# Altium schematic sheet 5VProtect.SchDoc
size B; SheetNumber: 11; SheetTotal: 15
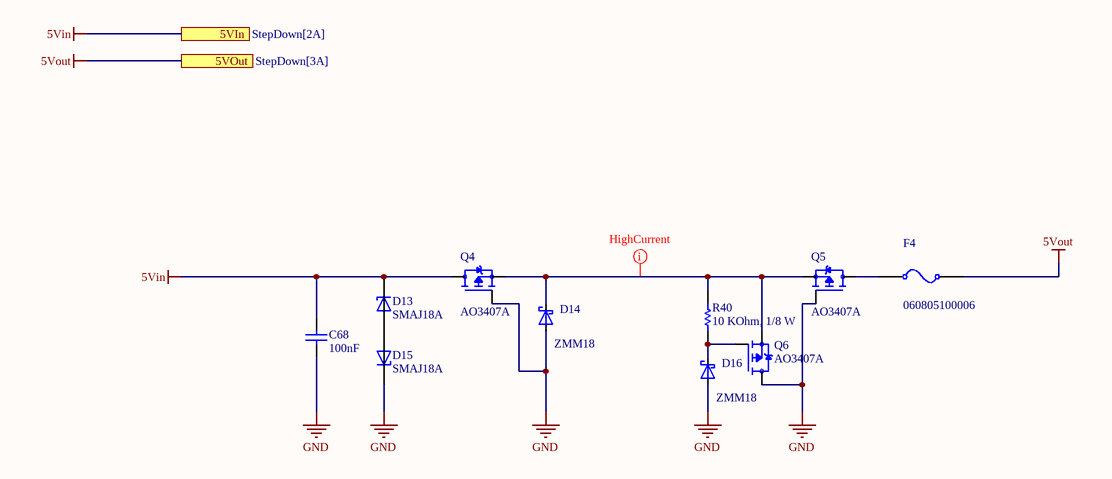
[diagram p0: 5VProtect.SchDoc]

## Parts
C68  value 100nF  [CAP_0805]  (hidden comment: 0108051041050)
D13  SMAJ18A  [DIOM4325X250N]
D14  ZMM18  [SOD-80_MiniMELF_Glass]
D15  SMAJ18A  [DIOM4325X250N]
D16  ZMM18  [SOD-80_MiniMELF_Glass]
F4  060805100006  [Fuse_SMD_0805]
Q4  AO3407A  [SOT95P280X125-3N]
Q5  AO3407A  [SOT95P280X125-3N]
Q6  AO3407A  [SOT95P280X125-3N]
R40  value 10 KOhm, 1/8 W  [RESISTOR_0805]  (hidden comment: 0008051031)

## Ports
5VIn (see StepDown[2A]), 5VOut (see StepDown[3A])

## Nets
5Vin: C68.2 D13.C Q4.3(D) ; port 5VIn
5Vout: F4.1 ; port 5VOut
GND: C68.1 D14.A D15.C D16.A Q4.1(G) Q5.1(G) Q6.3(D)
NetD13_A: D13.A D15.A
NetD14_K: D14.K Q4.2(S) Q5.2(S) Q6.2(S) R40.2
NetD16_K: D16.K Q6.1(G) R40.1
NetF4_0: F4.0 Q5.3(D)

## Layout directives
rule Width Constraint [Pref Width = 0.508mm    Min Width = 0.127mm    Max Width = 25.4mm]: NetD14_K

## Library data of the parts
C68 = CMP-001-00259-1: CAP, size 0805, 0.1 nF, 50 VDC; Manufacture Name: TDK; Manufacture SN: CGA4J2X8R1H104K125AD; Voltage Rating DC: 50 VDC; Tolerance: 10%; Pins: 2; Supplier 2 URL: https://www.digikey.com/en/products/detail/tdk-corporation/cga4j2x8r1h104k125ad/3248169; Supplier 1 SN: 810-C2012X8R1H104KEP; Supplier 1 Name: Mouser; Supplier 3 Name: thegioiic; Mounting Technology: SMT; Source: Capacitor_0805_10_percent.SchLib; Supplier 2 SN: 445-8810-2-ND; Supplier 3 SN: OEM; Operating Temperature: -55 to +125degC; Supplier 2 Name: Digi-Key; Component Type: Standard; Design Item ID: 0108051041050; Supplier 1 URL: https://www.mouser.vn/ProductDetail/TDK/CGA4J2X8R1H104K125AD?qs=LcTL%2F5vFEzExqZqv3rh1qQ%3D%3D&utm_source=mouser-refine-download&utm_medium=file&utm_campaign=CGA4J2X8R1H104K125AD&utm_content=TDK; Supplier 3 URL: N/A; Packaging: Tape and Reel; Size: 0805
D13 D15 = CMP-004-00085-1: 400W, 21.1V, 5%, Unidirectional, TVS; MF: Taiwan Semiconductor; SnapEDA_Link: https://www.snapeda.com/parts/SMAJ18A/taiwan/view-part/?ref=snap; Value: *; Component Type: Standard; Case/Package: SMA-2 Taiwan Semiconductor; Check_prices: https://www.snapeda.com/parts/SMAJ18A/taiwan/view-part/?ref=eda; Source: SMAJ18A.SchLib; Design Item ID: SMAJ18A; Pins: 2; MP: SMAJ18A
D14 D16 = CMP-004-00086-2: Value: Shottky-Diode; Reference: D; ki_keywords: Schottky; ki_description: Schottky Diode; Component Type: Standard; Pins: 2; Source: schottky-diode.SchLib; Design Item ID: Schottky-Diode; Datasheet: https://diotec.com/de/produktliste/SBD.html
F4 = CMP-005-00047-1: Resettable Fuse, Size 0805, 6V, 1A; Manufacturer: Littelfuse; Value: 6V,  1A; Threshold Current: 40A; Trip Current: 1.95A; Mounting Technology: SMT/SMD; Supplier 1 URL: https://www.mouser.vn/ProductDetail/Littelfuse/0805L100WR?qs=SJZ%252BTX%252BI2BTMlREVsW49pQ%3D%3D; Supplier 3 Name: thegioiic; Supplier 3 URL: https://www.thegioiic.com/0805l100wr-cau-chi-tu-phuc-hoi-0805-6v-1a; Supplier 3 SN: 0805L100WR; ComponentLink1URL: https://www.littelfuse.com/~/media/electronics/datasheets/resettable_ptcs/littelfuse_ptc_0805l_datasheet.pdf.pdf; Pins: 2; Supplier 1 SN: 576-0805L100; Component Type: Standard; Design Item ID: 060805100006; Threshold Voltage: 6V; ComponentLink1Description: Datasheet link; ComponentLink4Description: Supplier 3 URL; Supplier 1 Name: Mouser; Supplier 2 URL: https://www.mouser.vn/ProductDetail/Littelfuse/0805L100WR?qs=SJZ%252BTX%252BI2BTMlREVsW49pQ%3D%3D; Supplier 2 Name: Digi-Key; ComponentLink2URL: https://www.mouser.vn/ProductDetail/Littelfuse/0805L100WR?qs=SJZ%252BTX%252BI2BTMlREVsW49pQ%3D%3D; Hold Current: 1A; Source: Fuse_SMD.SchLib; ComponentLink3Description: Supplier 2 URL; Size: 0805; ComponentLink2Description: Supplier 1 URL; Supplier 2 SN: F2774TR-ND; ComponentLink3URL: https://www.digikey.com/en/products/detail/littelfuse-inc/0805L100WR/1212824; ComponentLink4URL: https://www.thegioiic.com/0805l100wr-cau-chi-tu-phuc-hoi-0805-6v-1a
Q4-Q6 = CMP-123-000000-1: P-Channel 30 V 4.3A (Ta) 1.4W (Ta) Surface Mount SOT-23-3; MF: Alpha &; Design Item ID: AO3407A; Check_prices: https://www.snapeda.com/parts/AO3407A/Alpha/view-part/?ref=eda; SnapEDA_Link: https://www.snapeda.com/parts/AO3407A/Alpha/view-part/?ref=snap; Source: AO3407A.SchLib; Pin Count: 3; Package: SOT-23 Alpha &amp; Omega Semiconductor; Value: *; Component Type: Standard; MP: AO3407A
R40 = CMP-009-00482-1: RES, size 0805, 10 KOhm, 1/8 W; Manufacture  Name: Vishay Dale; Manufacture  SN: CRCW080515K0FKEAC; Rated Power: 1/8 W; Resistance Tolerance: +/-1%; ComponentLink3URL: https://www.digikey.com/en/products/detail/vishay-dale/CRCW080515K0FKEAC/7928558; Supplier 3 SN: N/A; ComponentLink1URL: https://www.vishay.com/docs/28773/crcwce3.pdf; ComponentLink2Description: Supplier 1 URL; Mounting Technology: SMT; Supplier 1 SN: 71-CRCW0805-15K-E3; ComponentLink3Description: Supplier 2 URL; Pins: 2; Size: 0805; ComponentLink1Description: Datasheet link; Supplier 3 URL: N/A; Source: Resistor_0805.SchLib; Supplier 2 URL: https://www.digikey.com/en/products/detail/vishay-dale/CRCW080515K0FKEAC/7928558; ComponentLink4URL: N/A; Supplier 1 URL: https://www.mouser.vn/ProductDetail/Vishay-Dale/CRCW080515K0FKEA?qs=bMjB6bAaLEM4rXT2DoR3BA%3D%3D; Supplier 1 Name: Mouser; Design Item ID: 0008051531; Supplier 2 SN: 541-4136-2-ND; Component Type: Standard; ComponentLink2URL: https://www.mouser.vn/ProductDetail/Vishay-Dale/CRCW080515K0FKEA?qs=bMjB6bAaLEM4rXT2DoR3BA%3D%3D; Supplier 2 Name: Digi-Key; ComponentLink4Description: Supplier 3 URL; Supplier 3 Name: Thegioiic